# EAGLE schematic pro_event_light_a_mkI_modules (EAGLE 7.7.0)
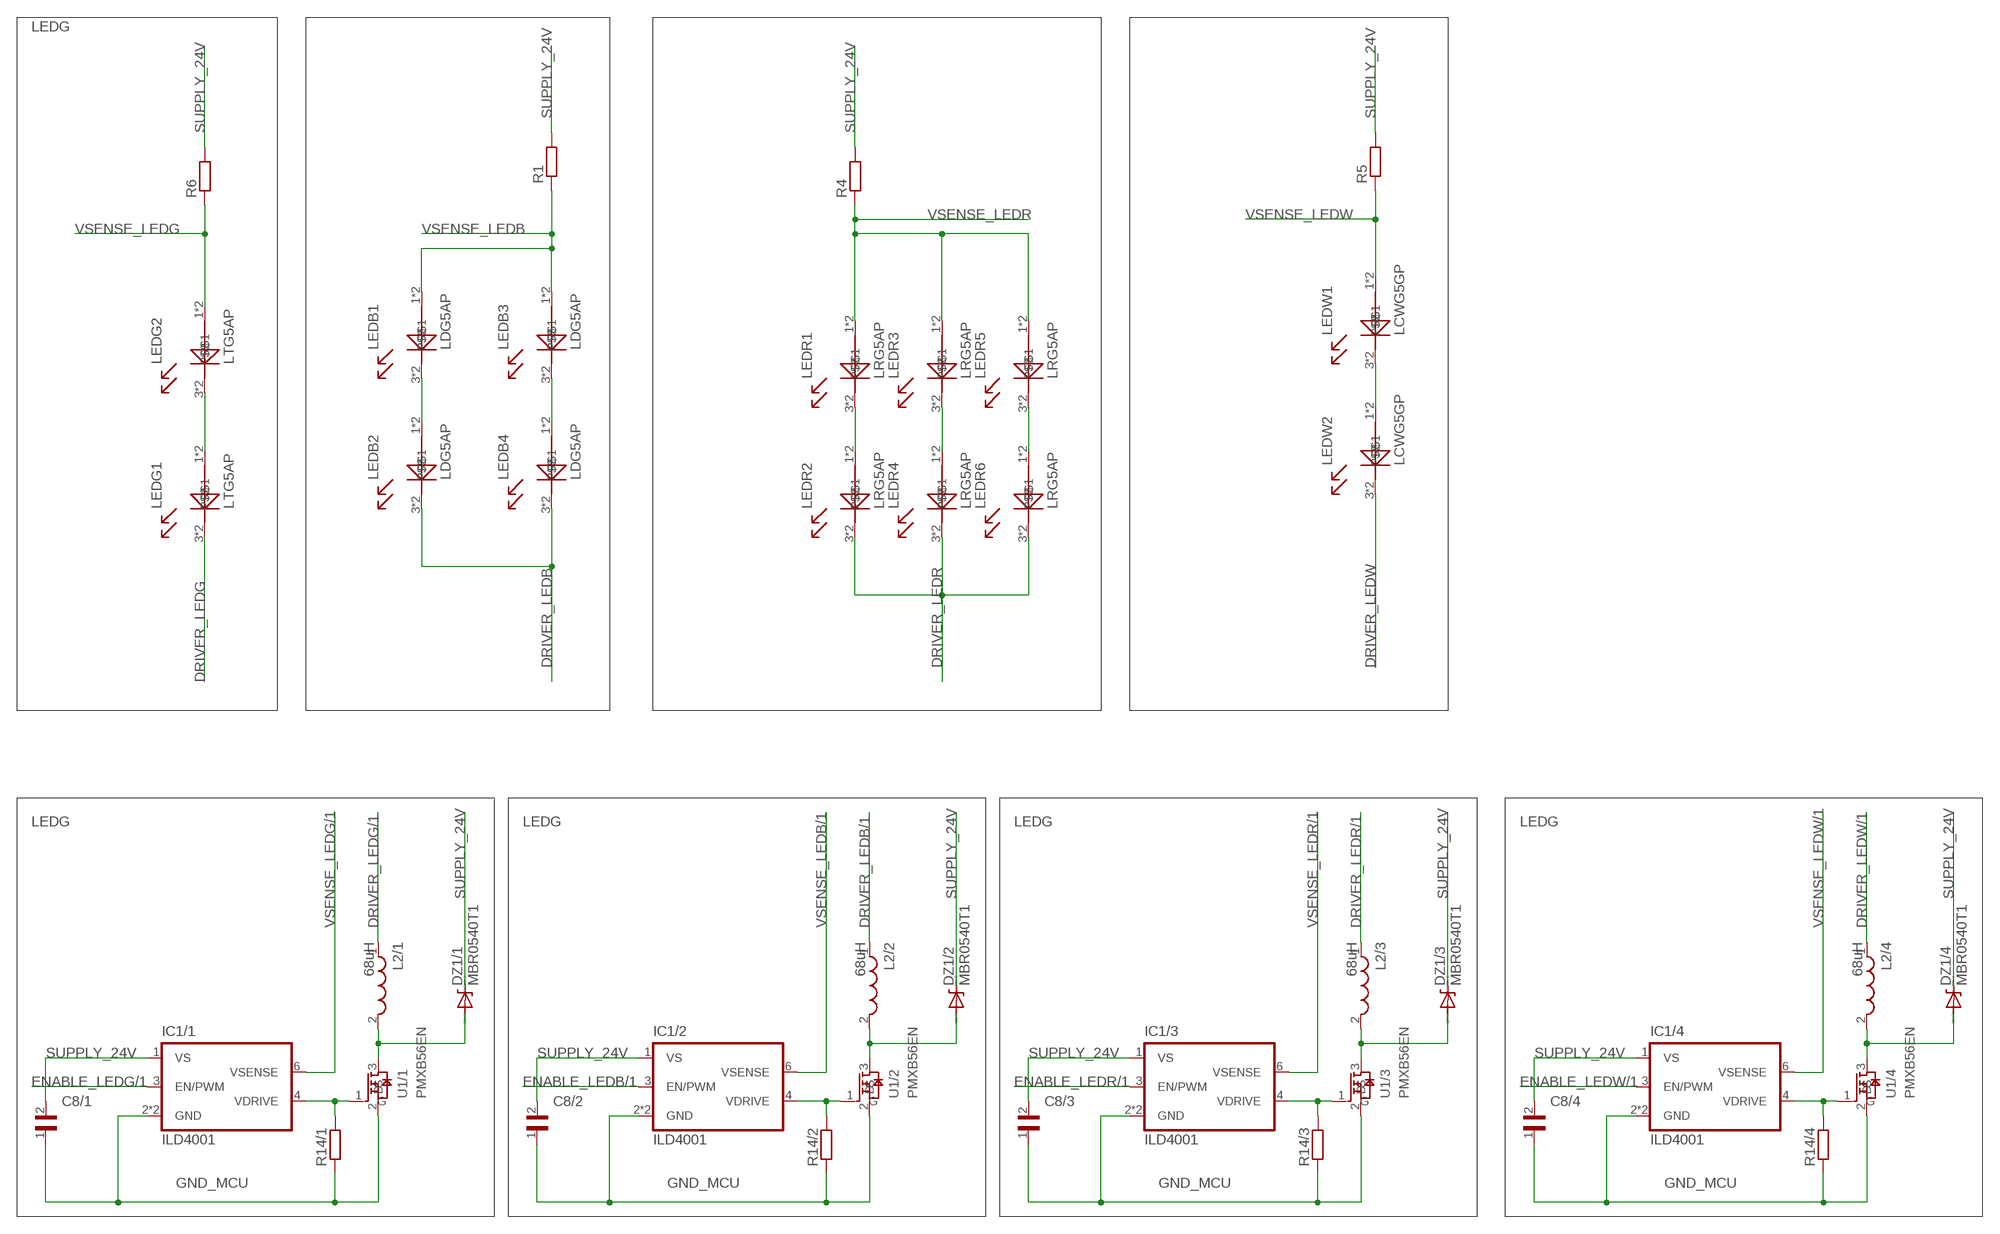
[diagram p0: schematic, sheet 1]

## Parts
C8/1  WCAP-CSGP_0603-WAVE  [WCAP-CSGP_0603_WAVE]
C8/2  WCAP-CSGP_0603-WAVE  [WCAP-CSGP_0603_WAVE]
C8/3  WCAP-CSGP_0603-WAVE  [WCAP-CSGP_0603_WAVE]
C8/4  WCAP-CSGP_0603-WAVE  [WCAP-CSGP_0603_WAVE]
DZ1/1  MBR0540T1  [SOD123]
DZ1/2  MBR0540T1  [SOD123]
DZ1/3  MBR0540T1  [SOD123]
DZ1/4  MBR0540T1  [SOD123]
IC1/1  ILD4001  [SC74_INFINEON]
IC1/2  ILD4001  [SC74_INFINEON]
IC1/3  ILD4001  [SC74_INFINEON]
IC1/4  ILD4001  [SC74_INFINEON]
L2/1  68uH  WE-LQ_1210  [WE-LQ_M]
L2/2  68uH  WE-LQ_1210  [WE-LQ_M]
L2/3  68uH  WE-LQ_1210  [WE-LQ_M]
L2/4  68uH  WE-LQ_1210  [WE-LQ_M]
LEDB1  LDG5AP  [P-LCC-2]
LEDB2  LDG5AP  [P-LCC-2]
LEDB3  LDG5AP  [P-LCC-2]
LEDB4  LDG5AP  [P-LCC-2]
LEDG1  LTG5AP  [P-LCC-2]
LEDG2  LTG5AP  [P-LCC-2]
LEDR1  LRG5AP  [P-LCC-2]
LEDR2  LRG5AP  [P-LCC-2]
LEDR3  LRG5AP  [P-LCC-2]
LEDR4  LRG5AP  [P-LCC-2]
LEDR5  LRG5AP  [P-LCC-2]
LEDR6  LRG5AP  [P-LCC-2]
LEDW1  LCWG5GP  [P-LCC-2]
LEDW2  LCWG5GP  [P-LCC-2]
R1  R-EU_R0603  [R0603]
R4  R-EU_R0603  [R0603]
R5  R-EU_R0603  [R0603]
R6  R-EU_R0603  [R0603]
R14/1  R-EU_R0603  [R0603]
R14/2  R-EU_R0603  [R0603]
R14/3  R-EU_R0603  [R0603]
R14/4  R-EU_R0603  [R0603]
U1/1  PMXB56EN  [DFN1010D-3]
U1/2  PMXB56EN  [DFN1010D-3]
U1/3  PMXB56EN  [DFN1010D-3]
U1/4  PMXB56EN  [DFN1010D-3]

## Nets
DRIVER_LEDB: LEDB2.3 LEDB2.4 LEDB4.3 LEDB4.4
DRIVER_LEDB/1: L2/2.1
DRIVER_LEDG: LEDG1.3 LEDG1.4
DRIVER_LEDG/1: L2/1.1
DRIVER_LEDR: LEDR2.3 LEDR2.4 LEDR4.3 LEDR4.4 LEDR6.3 LEDR6.4
DRIVER_LEDR/1: L2/3.1
DRIVER_LEDW: LEDW2.3 LEDW2.4
DRIVER_LEDW/1: L2/4.1
ENABLE_LEDB/1: IC1/2.3(EN/PWM)
ENABLE_LEDG/1: IC1/1.3(EN/PWM)
ENABLE_LEDR/1: IC1/3.3(EN/PWM)
ENABLE_LEDW/1: IC1/4.3(EN/PWM)
GND_MCU [MCU_Ground]: C8/1.1 C8/2.1 C8/3.1 C8/4.1 IC1/1.2(GND) IC1/1.5(GND) IC1/2.2(GND) IC1/2.5(GND) IC1/3.2(GND) IC1/3.5(GND) IC1/4.2(GND) IC1/4.5(GND) R14/1.1 R14/2.1 R14/3.1 R14/4.1 U1/1.2(S) U1/2.2(S) U1/3.2(S) U1/4.2(S)
N$1: DZ1/2.A L2/2.2 U1/2.3(D)
N$2: IC1/1.4(VDRIVE) R14/1.2 U1/1.1(G)
N$3: LEDG1.1 LEDG1.2 LEDG2.3 LEDG2.4
N$4: LEDB1.3 LEDB1.4 LEDB2.1 LEDB2.2
N$6: LEDB3.3 LEDB3.4 LEDB4.1 LEDB4.2
N$7: LEDR1.3 LEDR1.4 LEDR2.1 LEDR2.2
N$8: IC1/2.4(VDRIVE) R14/2.2 U1/2.1(G)
N$12: LEDR3.3 LEDR3.4 LEDR4.1 LEDR4.2
N$14: LEDR5.3 LEDR5.4 LEDR6.1 LEDR6.2
N$25: LEDW1.3 LEDW1.4 LEDW2.1 LEDW2.2
N$29: DZ1/1.A L2/1.2 U1/1.3(D)
N$32: DZ1/3.A L2/3.2 U1/3.3(D)
N$36: IC1/3.4(VDRIVE) R14/3.2 U1/3.1(G)
N$37: DZ1/4.A L2/4.2 U1/4.3(D)
N$38: IC1/4.4(VDRIVE) R14/4.2 U1/4.1(G)
SUPPLY_24V: C8/1.2 C8/2.2 C8/3.2 C8/4.2 DZ1/1.C DZ1/2.C DZ1/3.C DZ1/4.C IC1/1.1(VS) IC1/2.1(VS) IC1/3.1(VS) IC1/4.1(VS) R1.2 R4.2 R5.2 R6.2
VSENSE_LEDB: LEDB1.1 LEDB1.2 LEDB3.1 LEDB3.2 R1.1
VSENSE_LEDB/1: IC1/2.6(VSENSE)
VSENSE_LEDG: LEDG2.1 LEDG2.2 R6.1
VSENSE_LEDG/1: IC1/1.6(VSENSE)
VSENSE_LEDR: LEDR1.1 LEDR1.2 LEDR3.1 LEDR3.2 LEDR5.1 LEDR5.2 R4.1
VSENSE_LEDR/1: IC1/3.6(VSENSE)
VSENSE_LEDW: LEDW1.1 LEDW1.2 R5.1
VSENSE_LEDW/1: IC1/4.6(VSENSE)

## Notes on the sheet
- LEDG
- LEDG | LEDG | LEDG | LEDG

## Library data of the parts
C8/1-C8/4 = Eagle_Wurth_Elektronik_Passive_Capacitors_rev15a:WCAP-CSGP: WCAP-CSGP Ceramic Capacitors Characteristics Multilayer Ceramic Chip Capacitor Recommended soldering:Reflow, for 0603 and 0805 wave soldering is also allowed Operating temperature:-55 °C to +125 °C; Ceramic characteristics: Class I - NPO ; Class II -X7R, X5R High performance ceramic High capacitance stability Minimal aging Termination:Cu/Ni/Sn <http://katalog.we-online.de/media/images/eisos/WCAP-CSGP_pf2.jpg> Details see: http://katalog.we-online.de/en/pbs/WCAP-CSGP/?m Created: 2015-01-28 2015 (C) Wurth Elektronik
DZ1/1-DZ1/4 = mod_eagle_library_discrete_elements:MBR0540T1: MBR0540T1
IC1/1-IC1/4 = infineon:ILD4001: LED Driver for High Power LEDs Source: http://www.infineon.com/dgdl/ILD4001-Step-down-LED-Controller-Rev2.0.pdf?folderId=db3a30431f848401011fcbf2ab4c04c4&fileId=db3a30433072cd8f01308fc1af03786b
L2/1-L2/4 = EagleLibrary_Wuerth_Elektronik_eiSos_rev16a:WE-LQ: SMD Inductor Characteristics Miniature chip inductor wound on a special ferrite core Small inductances for compact circuits High Q at high frequencies Low DC-resistance Operating temperature: –40 ºC to +125 ºC Applications Low power DC/DC-converters from Linear Technology, National Semiconductor, Texas Instruments, Fairchild Semiconductor, ON Semiconductor, STMicroelectronics, Maxim, MPS, Semtech, Exar, Analogic Tech, Diodes and Cologne Chip EMI-Filtering RF-circuits <http://katalog.we-online.de/media/images/eisos/IndLQ_pf2.jpg> Details see: http://katalog.we-online.de/en/pbs/WE-LQ? Updated by Dan Xu 2014-07-08 2014 (C) Wurth Elektronik
LEDB1-LEDB4 = mod_eagle_library_discrete_elements:LDG5AP: OSRAM Advanced Power TOPLED LDG5AP deep blue
LEDG1 LEDG2 = mod_eagle_library_discrete_elements:LTG5AP: OSRAM Advanced Power TOPLED LTG5AP true green
LEDR1-LEDR6 = mod_eagle_library_discrete_elements:LRG5AP: OSRAM Advanced Power TOPLED LRG5AP single color red
LEDW1 LEDW2 = mod_eagle_library_discrete_elements:LCWG5GP: OSRAM Advanced Power TOPLED LCWG5GP warm white
R1 R4-R6 R14/1-R14/4 = rcl:R-EU_: RESISTOR, European symbol
U1/1-U1/4 = mod_eagle_library_discrete_elements:PMXB56EN

## Net classes
8 MCU_Ground: width 0.203 mm, drill 0.203 mm, clearance 0.152 mm to class 0, clearance 0.152 mm to class 1, clearance 0.152 mm to class 2, clearance 0.152 mm to class 3, clearance 0.152 mm to class 4, clearance 0.152 mm to class 5, clearance 0.152 mm to class 6, clearance 0.152 mm to class 7, clearance 0.152 mm